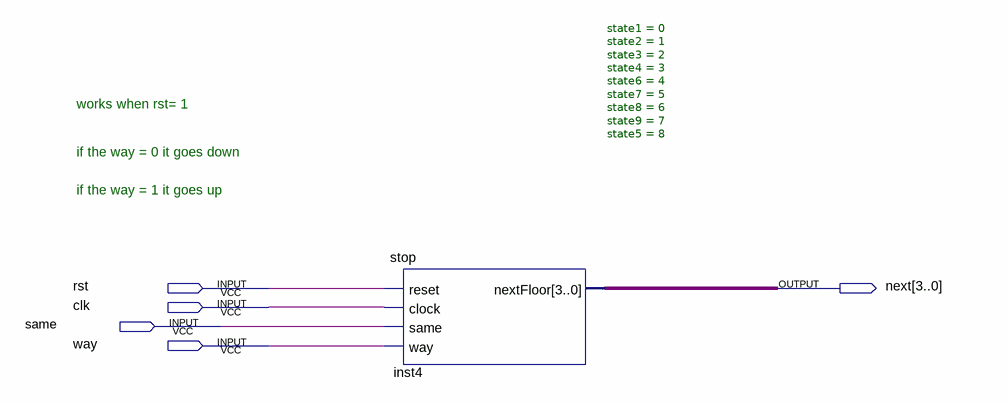
[diagram p0: schematic sheet]
// Quartus schematic moving.bdf as structural Verilog: 1 symbols, 5 pins
module moving (
  input  rst,
  input  clk,
  input  same,
  input  way,
  output [3:0] next
);

  stop #(.state1(0), .state2(1), .state3(2), .state4(3), .state6(4), .state7(5), .state8(6), .state9(7), .state5(8)) inst4 (
    .reset(rst), .clock(clk), .same(same), .way(way), .nextFloor(next));

  // Notes on the sheet:
  //   works when rst= 1
  //   if the way = 0 it goes down
  //   if the way = 1 it goes up
endmodule
